# EAGLE design Joypad (EAGLE 9.6.2)
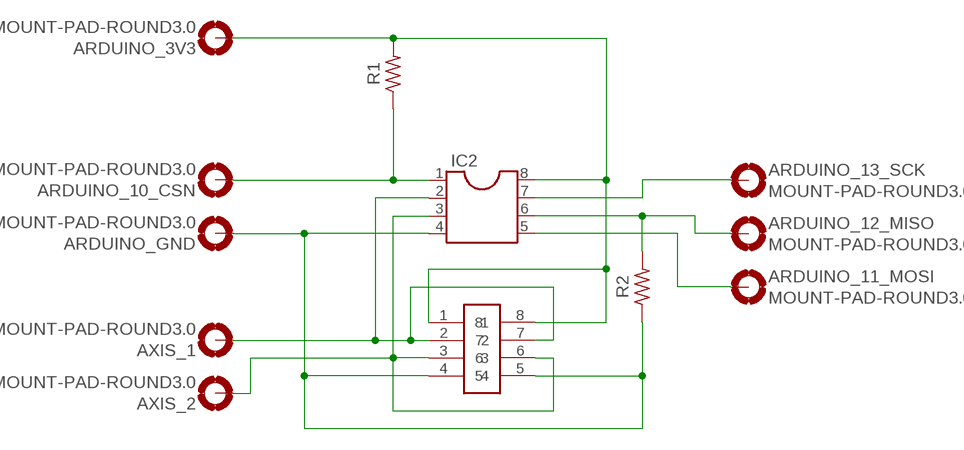
[diagram p0: schematic, sheet 1]

## Parts
ARDUINO_3V3  MOUNT-PAD-ROUND3.0  [3,0-PAD]
ARDUINO_10_CSN  MOUNT-PAD-ROUND3.0  [3,0-PAD]
ARDUINO_11_MOSI  MOUNT-PAD-ROUND3.0  [3,0-PAD]
ARDUINO_12_MISO  MOUNT-PAD-ROUND3.0  [3,0-PAD]
ARDUINO_13_SCK  MOUNT-PAD-ROUND3.0  [3,0-PAD]
ARDUINO_GND  MOUNT-PAD-ROUND3.0  [3,0-PAD]
AXIS_1  MOUNT-PAD-ROUND3.0  [3,0-PAD]
AXIS_2  MOUNT-PAD-ROUND3.0  [3,0-PAD]
IC2  DIL8S  [SOCKET-08]
R1  R-US_AXIAL-7.2MM-PITCH  [RESAD724W46L381D178B]
R2  R-US_AXIAL-7.2MM-PITCH  [RESAD724W46L381D178B]
U$1  JOYSTICK  [JOYSTICK]

## Nets
N$1: AXIS_1.B3,0(MOUNT) IC2.2 U$1.2 U$1.7
N$2: AXIS_2.B3,0(MOUNT) IC2.3 U$1.3 U$1.6
N$3: ARDUINO_12_MISO.B3,0(MOUNT) IC2.6 R2.2
N$4: ARDUINO_3V3.B3,0(MOUNT) IC2.8 R1.2 U$1.1 U$1.8
N$5: ARDUINO_10_CSN.B3,0(MOUNT) IC2.1 R1.1
N$6: ARDUINO_13_SCK.B3,0(MOUNT) IC2.7
N$7: ARDUINO_11_MOSI.B3,0(MOUNT) IC2.5
N$8: ARDUINO_GND.B3,0(MOUNT) IC2.4 R2.1 U$1.4 U$1.5

## Library data of the parts
ARDUINO_3V3 ARDUINO_10_CSN ARDUINO_11_MOSI ARDUINO_12_MISO ARDUINO_13_SCK ARDUINO_GND AXIS_1 AXIS_2 = holes:MOUNT-PAD-ROUND: MOUNTING PAD, round
IC2 = ic-package:DIL8: Dual In Line / Socket
R1 R2 = Resistor:R-US: Resistor Fixed - ANSI; CATEGORY: Resistor; SUB-CATEGORY: Fixed
U$1 = JOYPAD:JOYSTICK

## Board
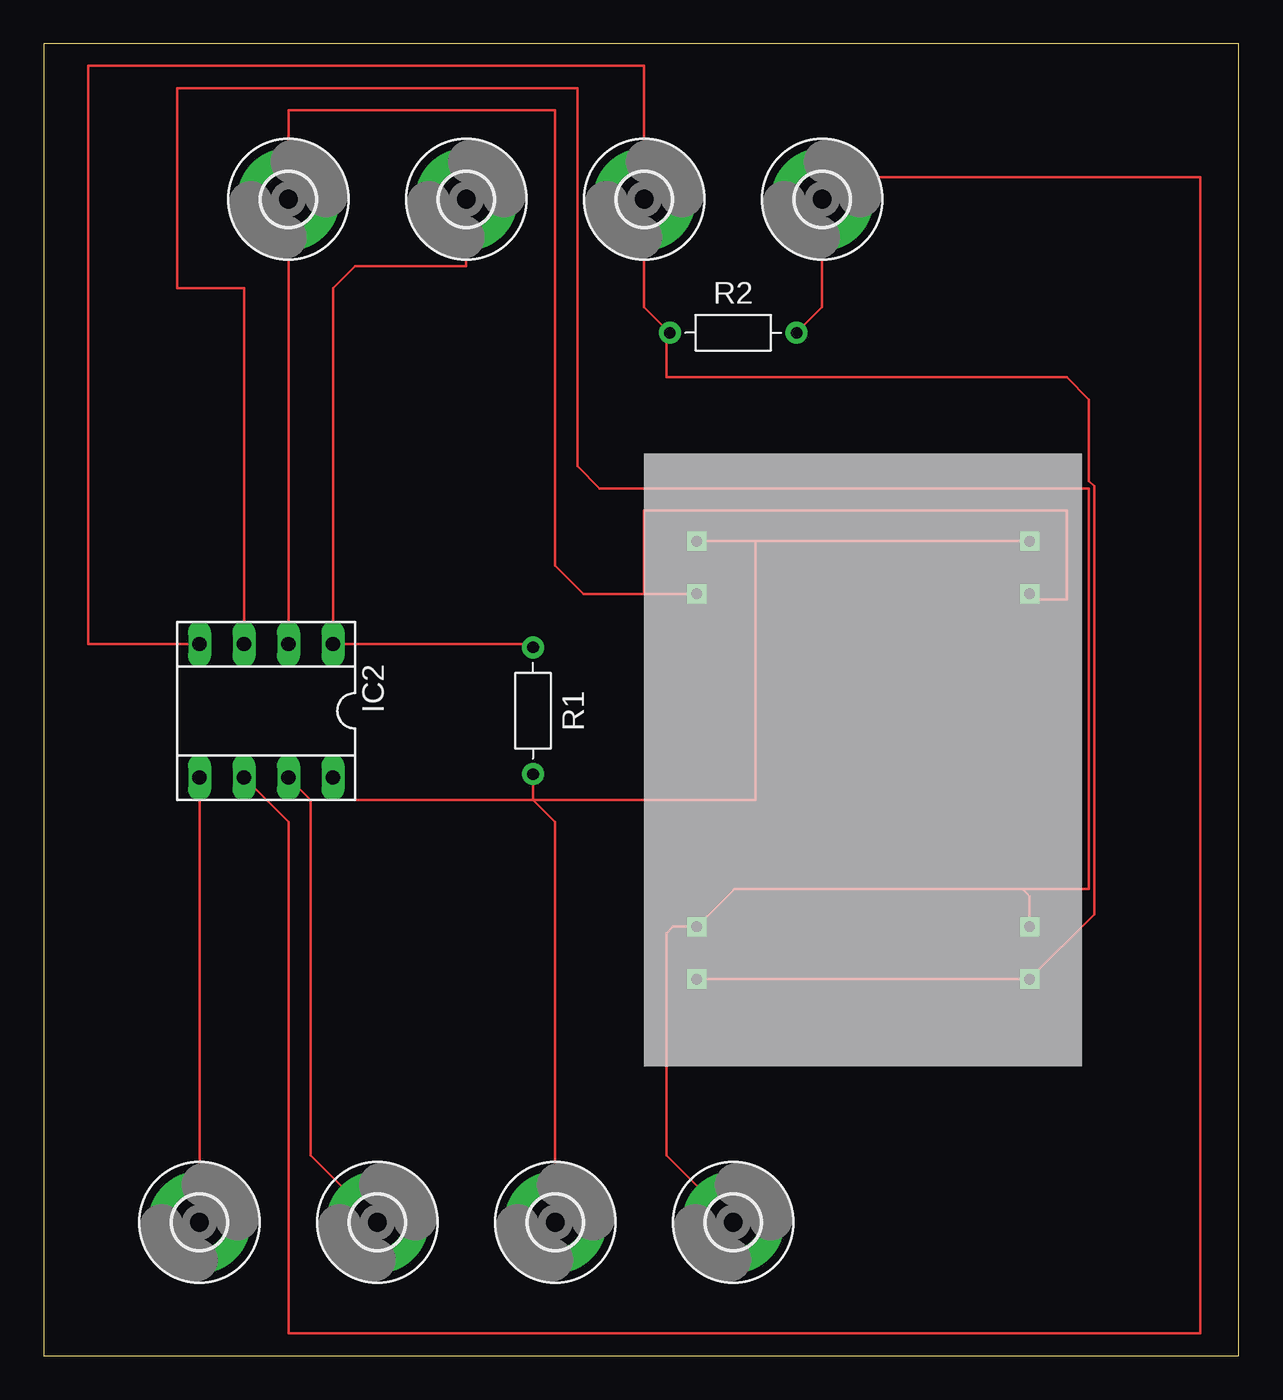
[diagram p1: board, top side]

Size 68.25 x 74.92 mm. Coordinates in mm from the lower left corner, seen from the top.
Outline: 0,0 68.25,0 68.25,74.92 0,74.92 0,0
Copper layers (1*16): Top 0.035mm / dielectric 1.5mm / Bottom 0.035mm
Design rules "default": minimum track width 6mil, minimum drill 0.35mm, track to track 6mil, track to pad 6mil, pad to pad 6mil, via to via 6mil, smd to smd 6mil, copper to edge 40mil, drill to drill 6mil, minimum pad ring 10mil, minimum via ring 8mil, stop-mask expansion 4mil, vias tented up to drill 0mil, thermal gap 10mil

### Footprints (pad centres in the part's own frame; a part is rotated, then mirrored left to right if it is on the bottom)
3,0-PAD = drill 3 pad 5.842: B3,0 0,0
SOCKET-08 = drill 0.813 long: 1 -3.81,-3.81; 2 -1.27,-3.81; 3 1.27,-3.81; 4 3.81,-3.81; 5 3.81,3.81; 6 1.27,3.81; 7 -1.27,3.81; 8 -3.81,3.81
RESAD724W46L381D178B = drill 0.66 pad 1.26: 1 -3.62,0; 2 3.62,0
JOYSTICK = drill 0.6 square: 1 3,30; 2 3,27; 3 3,8; 4 3,5; 5 22,5; 6 22,8; 7 22,27; 8 22,30

### Placement (x,y rotation side)
ARDUINO_3V3  29.21,7.62 0 top
ARDUINO_10_CSN  24.13,66.04 0 top
ARDUINO_11_MOSI  8.89,7.62 0 top
ARDUINO_12_MISO  44.45,66.04 0 top
ARDUINO_13_SCK  19.05,7.62 0 top
ARDUINO_GND  34.29,66.04 0 top
AXIS_1  13.97,66.04 0 top
AXIS_2  39.37,7.62 0 top
IC2  12.7,36.83 180 top
R1  27.94,36.83 270 top
R2  39.37,58.42 0 top
U$1  34.29,16.51 0 top

### Tracks (layer width: path | path; a pad name or v marks a point on that pad's centre or on a via)
N$1
  Top 0.152: IC2.2 AXIS_1.B3,0 13.97,71.12 29.21,71.12 29.21,45.11 30.81,43.51 34.29,43.51 | U$1.2 34.29,43.51 | 34.29,43.51 34.29,48.26 58.42,48.26 58.42,43.18 56.62,43.18 U$1.7
N$2
  Top 0.152: IC2.3 11.43,60.96 7.62,60.96 7.62,72.39 30.48,72.39 30.48,50.8 31.75,49.53 59.69,49.53 59.69,26.67 55.88,26.67 | 55.88,26.67 39.45,26.67 U$1.3 35.94,24.51 35.56,24.13 35.56,11.43 AXIS_2.B3,0 | U$1.6 56.29,26.26 55.88,26.67
N$3
  Top 0.152: R2.2 44.45,59.88 ARDUINO_12_MISO.B3,0 45.72,67.31 66.04,67.31 66.04,1.27 13.97,1.27 13.97,30.48 IC2.6
N$4
  Top 0.152: IC2.8 16.51,31.75 27.94,31.75 | U$1.1 40.64,46.51 | 40.64,46.51 U$1.8 | 40.64,46.51 40.64,31.75 27.94,31.75 | R1.2 27.94,31.75 | 27.94,31.75 29.21,30.48 ARDUINO_3V3.B3,0
N$5
  Top 0.152: ARDUINO_10_CSN.B3,0 24.13,62.23 17.78,62.23 16.51,60.96 IC2.1 27.75,40.64 R1.1
N$6
  Top 0.152: IC2.7 15.24,31.75 15.24,11.43 ARDUINO_13_SCK.B3,0
N$7
  Top 0.152: IC2.5 ARDUINO_11_MOSI.B3,0
N$8
  Top 0.152: R2.1 35.66,58.52 | 35.66,58.52 34.29,59.88 ARDUINO_GND.B3,0 34.29,73.66 2.54,73.66 2.54,40.64 IC2.4 | U$1.4 U$1.5 59.99,25.22 59.99,49.66 59.69,49.96 59.69,54.61 58.42,55.88 35.56,55.88 35.56,58.42 35.66,58.52